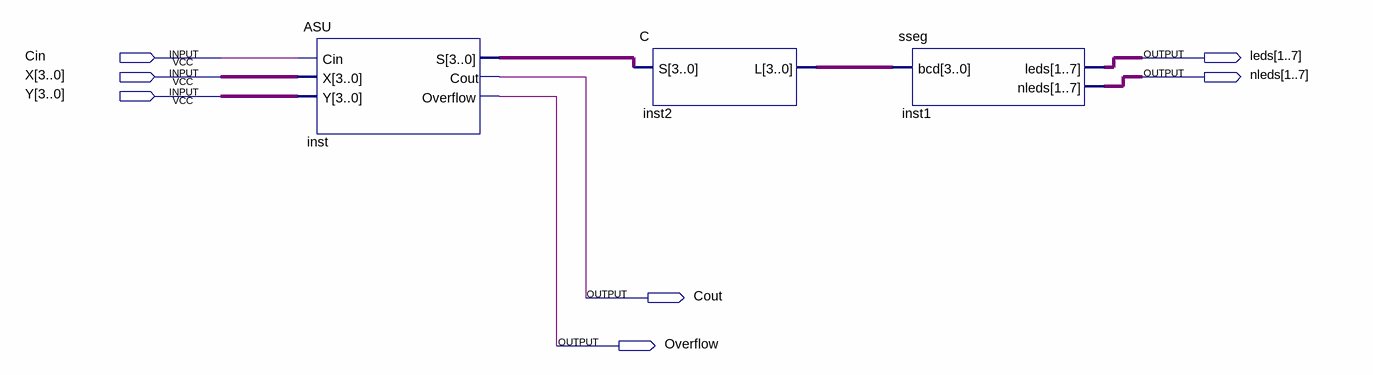
[diagram p0: schematic sheet]
// Quartus schematic CombinedASU2.bdf as structural Verilog: 3 symbols, 7 pins
module CombinedASU2 (
  input  Cin,
  input  [3:0] X,
  input  [3:0] Y,
  output [1:7] leds,
  output [1:7] nleds,
  output Cout,
  output Overflow
);

  wire [3:0] inst2_l, inst_s;

  ASU inst (.Cin(Cin), .X(X), .Y(Y), .S(inst_s), .Cout(Cout), .Overflow(Overflow));
  C inst2 (.S(inst_s), .L(inst2_l));
  sseg inst1 (.bcd(inst2_l), .leds(leds), .nleds(nleds));
endmodule
